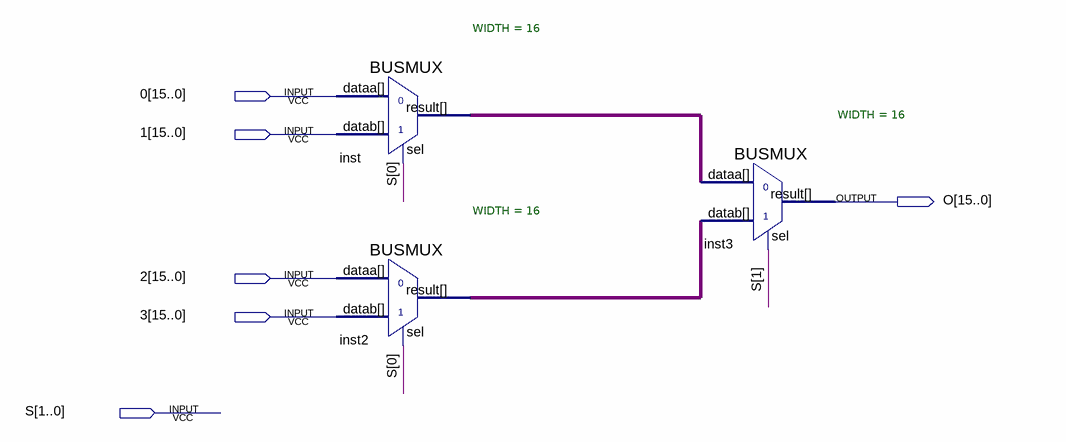
[diagram p0: schematic sheet]
// Quartus schematic MUX4TO1.bdf as structural Verilog: 3 symbols, 6 pins
module MUX4TO1 (
  input  [15:0] \0 ,
  input  [15:0] \1 ,
  input  [15:0] \2 ,
  input  [15:0] \3 ,
  input  [1:0] S,
  output [15:0] O
);

  wire [15:0] inst2_result, inst_result;

  BUSMUX #(.WIDTH(16)) inst (.datab(\1 ), .sel(S[0]), .dataa(\0 ), .result(inst_result));
  BUSMUX #(.WIDTH(16)) inst2 (.datab(\3 ), .sel(S[0]), .dataa(\2 ), .result(inst2_result));
  BUSMUX #(.WIDTH(16)) inst3 (.datab(inst2_result), .sel(S[1]), .dataa(inst_result), .result(O));
endmodule
